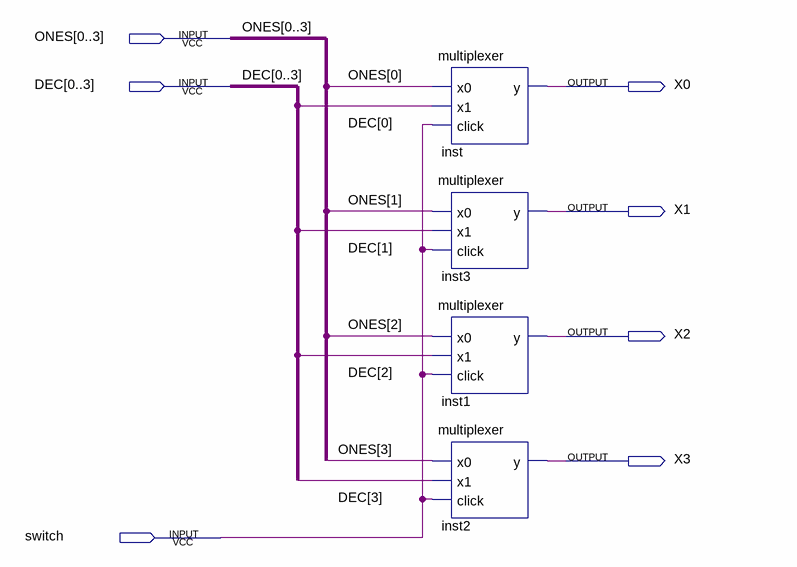
[diagram p0: schematic sheet]
// Quartus schematic multiplextor_BIG.bdf as structural Verilog: 4 symbols, 7 pins
module multiplextor_BIG (
  input  [0:3] ONES,
  input  [0:3] DEC,
  input  switch,
  output X0,
  output X1,
  output X2,
  output X3
);

  multiplexer inst (.x0(ONES[0]), .x1(DEC[0]), .click(switch), .y(X0));
  multiplexer inst3 (.x0(ONES[1]), .x1(DEC[1]), .click(switch), .y(X1));
  multiplexer inst1 (.x0(ONES[2]), .x1(DEC[2]), .click(switch), .y(X2));
  multiplexer inst2 (.x0(ONES[3]), .x1(DEC[3]), .click(switch), .y(X3));
endmodule
